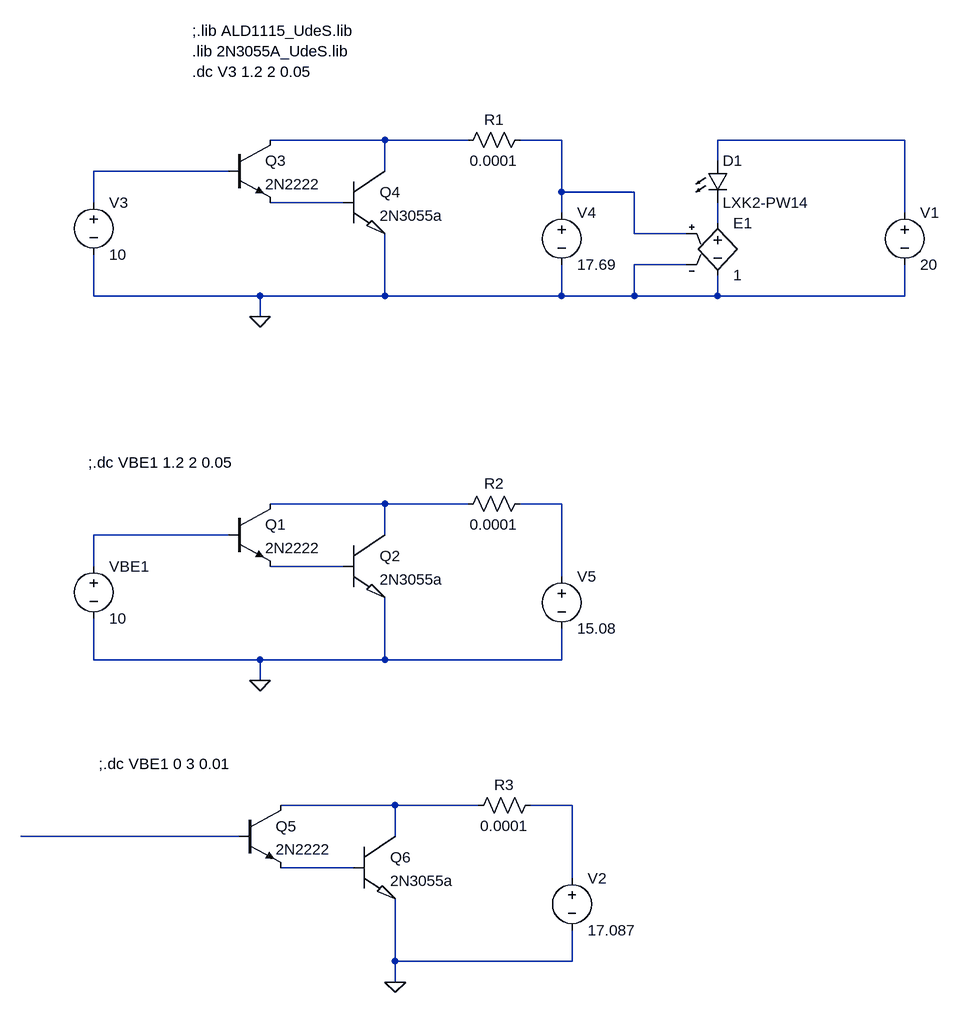
[diagram p0: schematic E5.asc]
E5.asc, the LTspice schematic file:
Version 4
SHEET 1 1500 1456
WIRE 640 144 464 144
WIRE 768 144 640 144
WIRE 912 144 848 144
WIRE 1440 144 1152 144
WIRE 1152 176 1152 144
WIRE 400 192 192 192
WIRE 640 192 640 144
WIRE 912 224 912 144
WIRE 1024 224 912 224
WIRE 192 240 192 192
WIRE 576 240 464 240
WIRE 912 256 912 224
WIRE 1440 256 1440 144
WIRE 1152 272 1152 240
WIRE 1024 288 1024 224
WIRE 1104 288 1024 288
WIRE 1104 336 1024 336
WIRE 192 384 192 320
WIRE 448 384 192 384
WIRE 640 384 640 288
WIRE 640 384 448 384
WIRE 912 384 912 336
WIRE 912 384 640 384
WIRE 1024 384 1024 336
WIRE 1024 384 912 384
WIRE 1152 384 1152 352
WIRE 1152 384 1024 384
WIRE 1440 384 1440 336
WIRE 1440 384 1152 384
WIRE 448 416 448 384
WIRE 640 704 464 704
WIRE 768 704 640 704
WIRE 912 704 848 704
WIRE 400 752 192 752
WIRE 640 752 640 704
WIRE 192 800 192 752
WIRE 576 800 464 800
WIRE 912 816 912 704
WIRE 192 944 192 880
WIRE 448 944 192 944
WIRE 640 944 640 848
WIRE 640 944 448 944
WIRE 912 944 912 896
WIRE 912 944 640 944
WIRE 448 976 448 944
WIRE 656 1168 480 1168
WIRE 784 1168 656 1168
WIRE 928 1168 864 1168
WIRE 416 1216 80 1216
WIRE 656 1216 656 1168
WIRE 592 1264 480 1264
WIRE 928 1280 928 1168
WIRE 656 1408 656 1312
WIRE 928 1408 928 1360
WIRE 928 1408 656 1408
WIRE 656 1440 656 1408
FLAG 448 416 0
FLAG 448 976 0
FLAG 656 1440 0
SYMBOL Voltage 192 224 R0
SYMATTR InstName V3
SYMATTR Value 10
SYMBOL npn 400 144 R0
SYMATTR InstName Q3
SYMATTR Value 2N2222
SYMBOL Res 864 128 R90
WINDOW 0 0 56 VBottom 2
WINDOW 3 32 56 VTop 2
SYMATTR InstName R1
SYMATTR Value 0.0001
SYMBOL Voltage 912 240 R0
SYMATTR InstName V4
SYMATTR Value 17.69
SYMBOL LED 1136 176 R0
SYMATTR InstName D1
SYMATTR Value LXK2-PW14
SYMATTR Description Diode
SYMATTR Type diode
SYMBOL e 1152 256 R0
SYMATTR InstName E1
SYMATTR Value 1
SYMBOL Voltage 1440 240 R0
SYMATTR InstName V1
SYMATTR Value 20
SYMBOL 2N3055a 576 192 R0
SYMATTR InstName Q4
SYMBOL Voltage 192 784 R0
SYMATTR InstName VBE1
SYMATTR Value 10
SYMBOL npn 400 704 R0
SYMATTR InstName Q1
SYMATTR Value 2N2222
SYMBOL Res 864 688 R90
WINDOW 0 0 56 VBottom 2
WINDOW 3 32 56 VTop 2
SYMATTR InstName R2
SYMATTR Value 0.0001
SYMBOL Voltage 912 800 R0
SYMATTR InstName V5
SYMATTR Value 15.08
SYMBOL 2N3055a 576 752 R0
SYMATTR InstName Q2
SYMBOL npn 416 1168 R0
SYMATTR InstName Q5
SYMATTR Value 2N2222
SYMBOL Res 880 1152 R90
WINDOW 0 0 56 VBottom 2
WINDOW 3 32 56 VTop 2
SYMATTR InstName R3
SYMATTR Value 0.0001
SYMBOL Voltage 928 1264 R0
SYMATTR InstName V2
SYMATTR Value 17.087
SYMBOL 2N3055a 592 1216 R0
SYMATTR InstName Q6
TEXT 344 -24 Left 2 !;.lib ALD1115_UdeS.lib\n.lib 2N3055A_UdeS.lib\n.dc V3 1.2 2 0.05
TEXT 184 640 Left 2 !;.dc VBE1 1.2 2 0.05
TEXT 200 1104 Left 2 !;.dc VBE1 0 3 0.01

The netlist it stands for:
* E5.asc
V3 N004 0 10
Q3 N001 N004 N005 0 2N2222
R1 N002 N001 0.0001
V4 N002 0 17.69
D1 N003 N006 LXK2-PW14
E1 N006 0 N002 0 1
V1 N003 0 20
Q4 N001 N005 0 0 2N3055a
VBE1 N009 0 10
Q1 N007 N009 N010 0 2N2222
R2 N008 N007 0.0001
V5 N008 0 15.08
Q2 N007 N010 0 0 2N3055a
Q5 N011 N013 N014 0 2N2222
R3 N012 N011 0.0001
V2 N012 0 17.087
Q6 N011 N014 0 0 2N3055a
.model D D
.lib standard.dio
.model NPN NPN
.model PNP PNP
.lib standard.bjt
;.lib ALD1115_UdeS.lib
.lib 2N3055A_UdeS.lib
.dc V3 1.2 2 0.05
;.dc VBE1 1.2 2 0.05
;.dc VBE1 0 3 0.01
.lib 2N3055A_UdeS.lib
.backanno
.end